# Altium schematic sheet Mainboard_v1_1.SchDoc: Aerator Converter V1.1
size 571 x 275 mm; CheckedBy: Dr. Hung; DrawnBy: Thanh Tam; Engineer: Thanh Tam; SheetNumber: 1; SheetTotal: 3
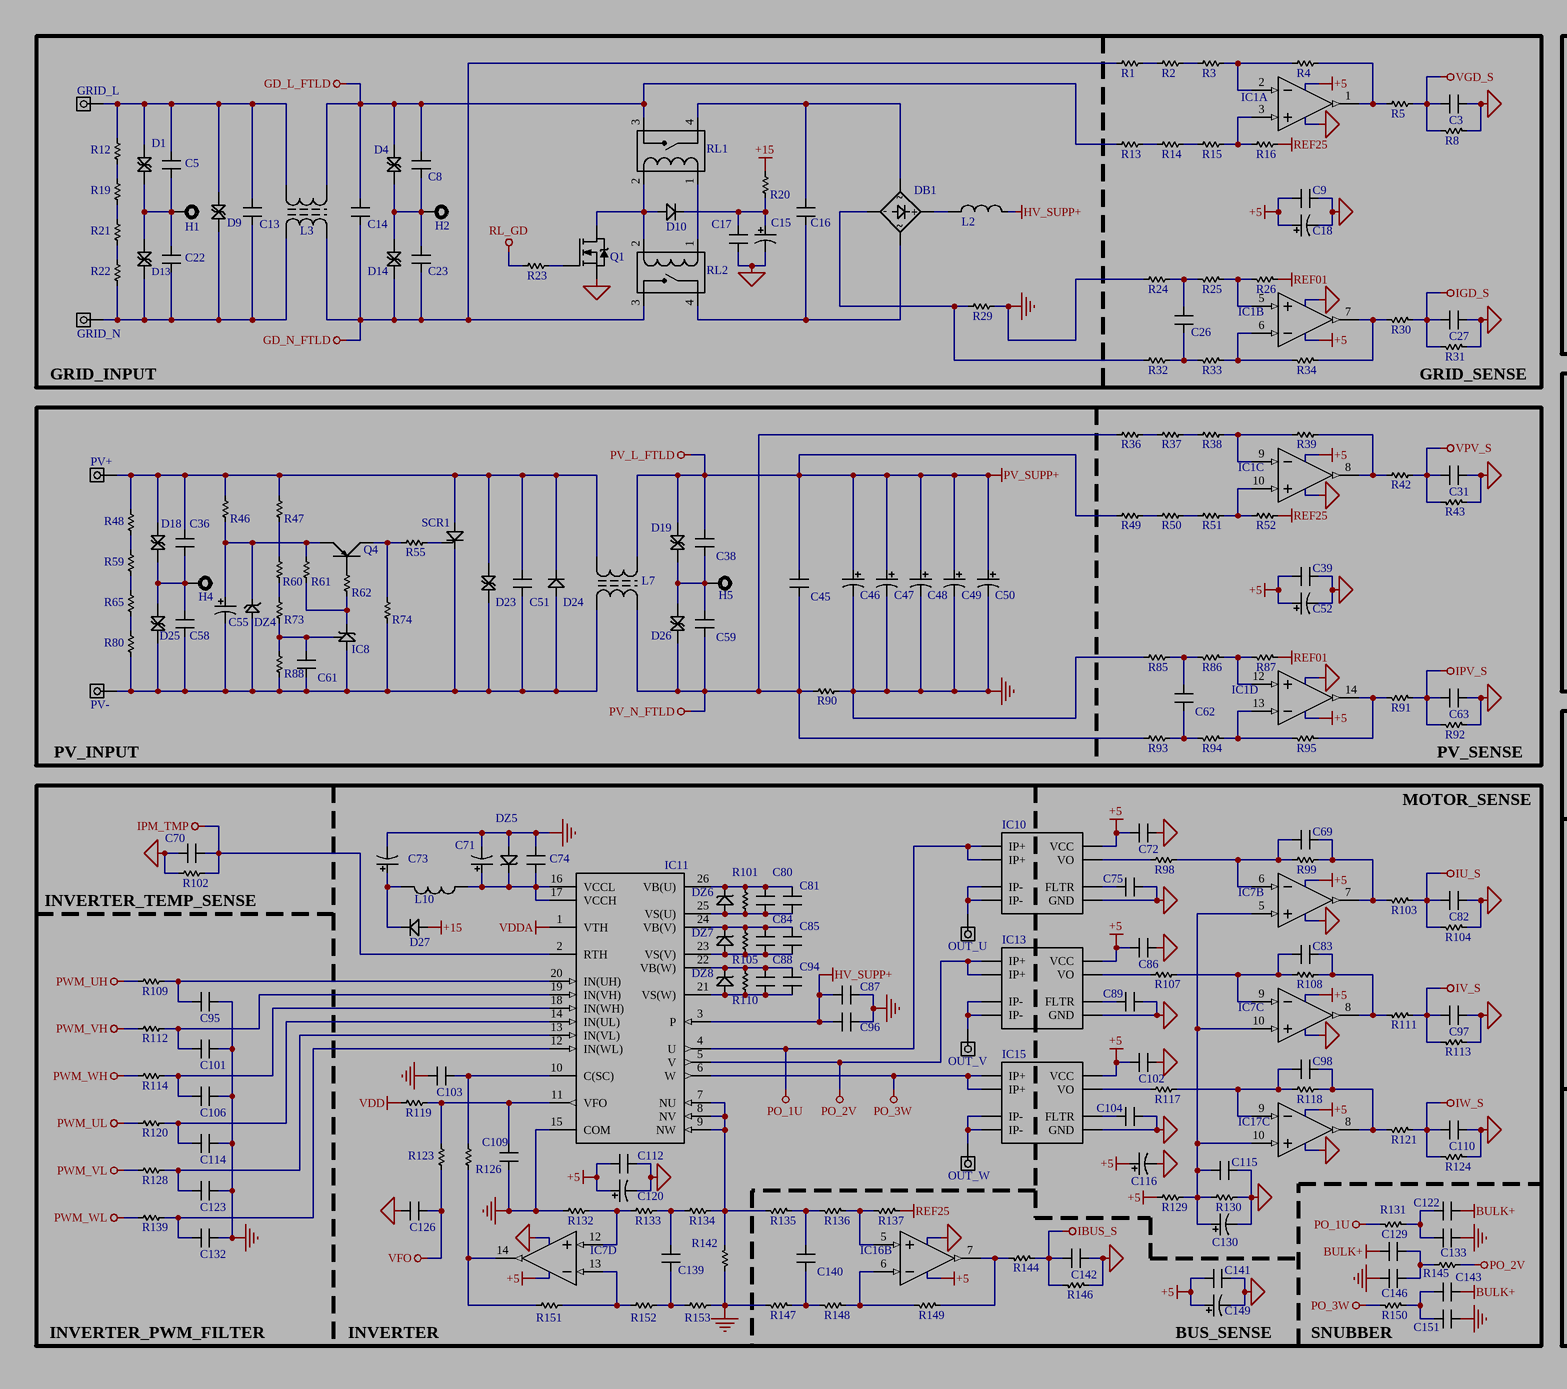
[diagram p0: Mainboard_v1_1.SchDoc, left]
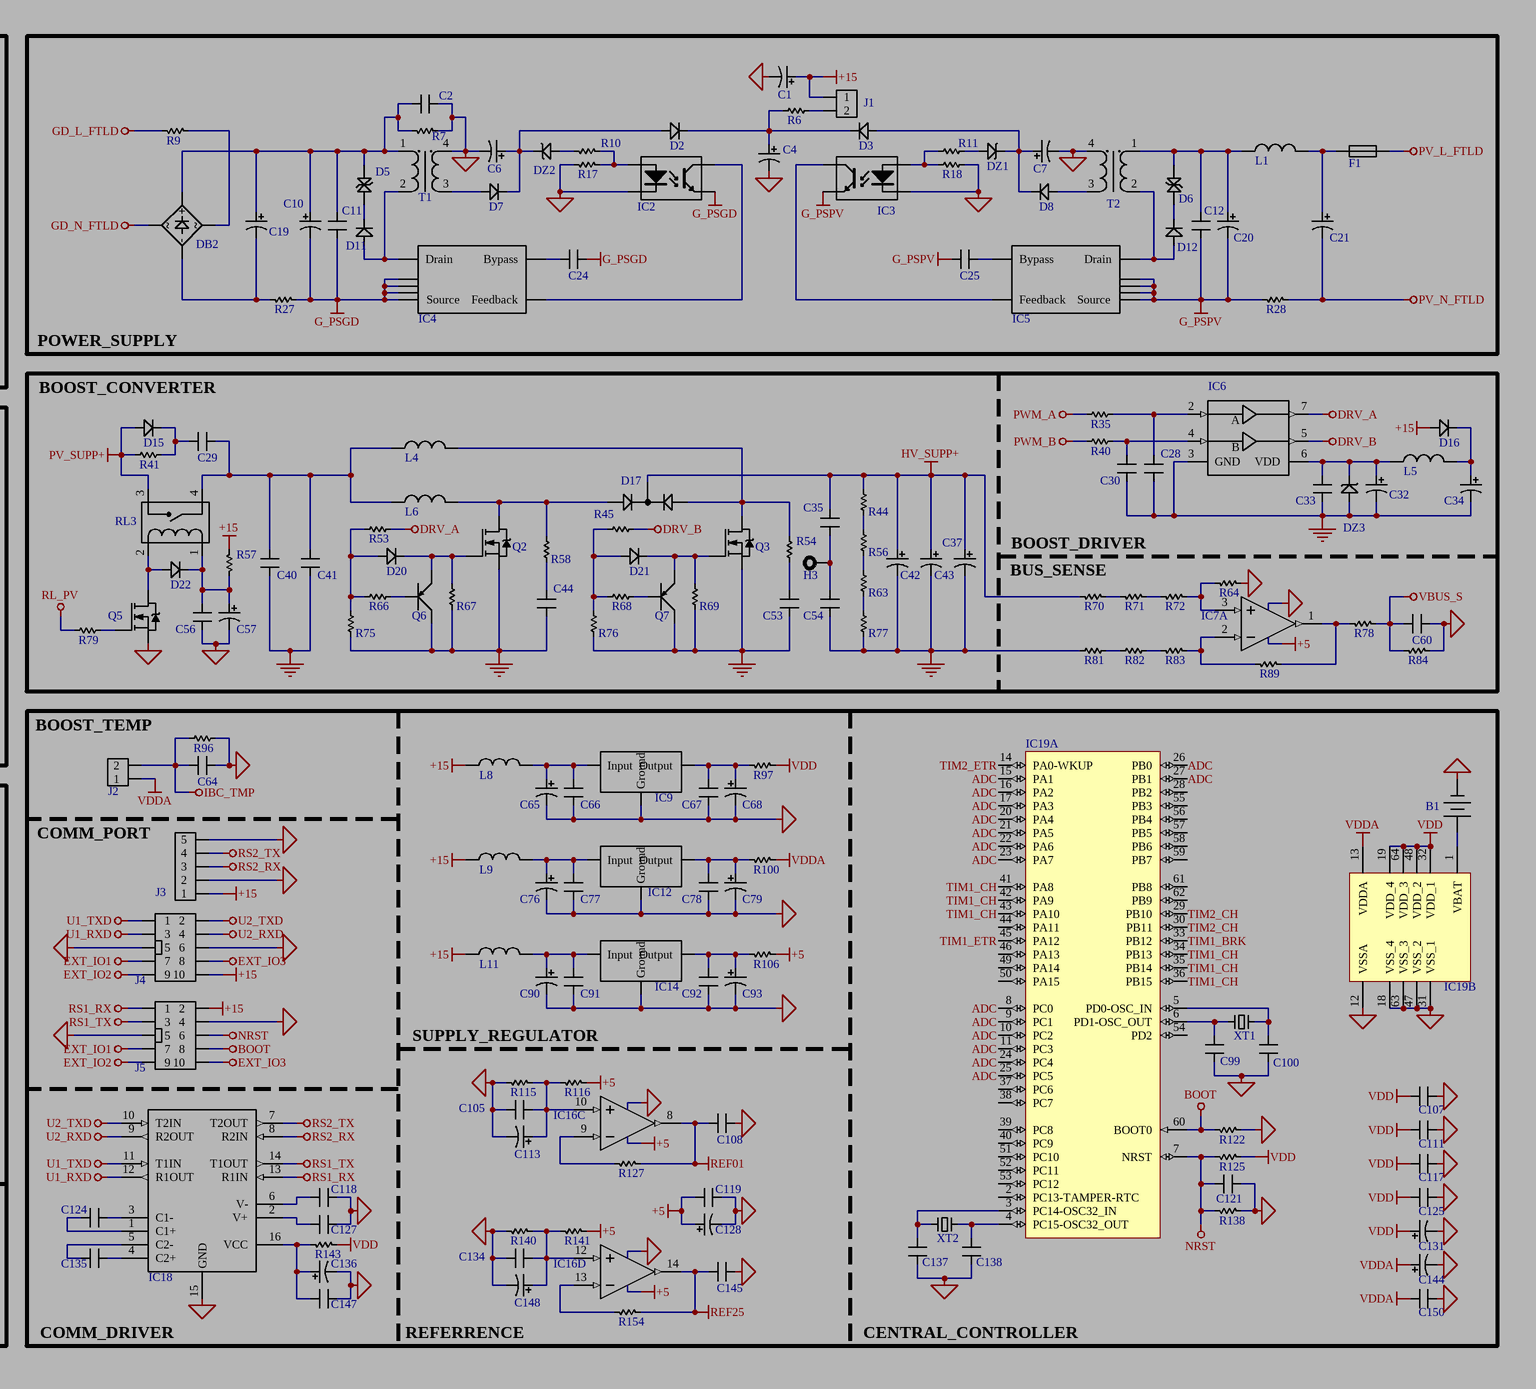
[diagram p1: Mainboard_v1_1.SchDoc, right]

## Parts
B1  BATTERY  (value not drawn)
C1  CAP-POL  [CAP-ELECT-5]  (value not drawn)
C2  104  [CAP20]  (value not drawn)
C3  104  [CAP20]  (value not drawn)
C4  CAP-POL  [CAP-ELECT-5]  (value not drawn)
C5  104  [CAP20]  (value not drawn)
C6  CAP-POL  [CAP-ELECT-5]  (value not drawn)
C7  CAP-POL  [CAP-ELECT-5]  (value not drawn)
C8  104  [CAP20]  (value not drawn)
C9  104  [CAP20]  (value not drawn)
C10  CAP-POL  [CAP-ELECT-5]  (value not drawn)
C11  104  [CAP20]  (value not drawn)
C12  104  [CAP20]  (value not drawn)
C13  104  [CAP20]  (value not drawn)
C14  104  [CAP20]  (value not drawn)
C15  CAP-POL  [CAP-ELECT-5]  (value not drawn)
C16  NULL  [CAP20]  (value not drawn)
C17  CAP  [CAP20]  (value not drawn)
C18  CAP-POL  [CAP-ELECT-5]  (value not drawn)
C19  CAP-POL  [CAP-ELECT-5]  (value not drawn)
C20  CAP-POL  [CAP-ELECT-5]  (value not drawn)
C21  CAP-POL  [CAP-ELECT-5]  (value not drawn)
C22  104  [CAP20]  (value not drawn)
C23  104  [CAP20]  (value not drawn)
C24  104  [CAP20]  (value not drawn)
C25  104  [CAP20]  (value not drawn)
C26  104  [CAP20]  (value not drawn)
C27  104  [CAP20]  (value not drawn)
C28  104  [CAP20]  (value not drawn)
C29  104  [CAP20]  (value not drawn)
C30  104  [CAP20]  (value not drawn)
C31  104  [CAP20]  (value not drawn)
C32  CAP-POL  [CAP-ELECT-5]  (value not drawn)
C33  104  [CAP20]  (value not drawn)
C34  CAP-POL  [CAP-ELECT-5]  (value not drawn)
C35  104  [CAP20]  (value not drawn)
C36  104  [CAP20]  (value not drawn)
C37  CAP-POL  [CAP-ELECT-5]  (value not drawn)
C38  104  [CAP20]  (value not drawn)
C39  104  [CAP20]  (value not drawn)
C40  104  [CAP20]  (value not drawn)
C41  104  [CAP20]  (value not drawn)
C42  CAP-POL  [CAP-ELECT-5]  (value not drawn)
C43  CAP-POL  [CAP-ELECT-5]  (value not drawn)
C44  104  [CAP20]  (value not drawn)
C45  104  [CAP20]  (value not drawn)
C46  CAP-POL  [CAP-ELECT-5]  (value not drawn)
C47  CAP-POL  [CAP-ELECT-5]  (value not drawn)
C48  CAP-POL  [CAP-ELECT-5]  (value not drawn)
C49  CAP-POL  [CAP-ELECT-5]  (value not drawn)
C50  CAP-POL  [CAP-ELECT-5]  (value not drawn)
C51  104  [CAP20]  (value not drawn)
C52  CAP-POL  [CAP-ELECT-5]  (value not drawn)
C53  104  [CAP20]  (value not drawn)
C54  104  [CAP20]  (value not drawn)
C55  CAP-POL  [CAP-ELECT-5]  (value not drawn)
C56  104  [CAP20]  (value not drawn)
C57  CAP-POL  [CAP-ELECT-5]  (value not drawn)
C58  104  [CAP20]  (value not drawn)
C59  104  [CAP20]  (value not drawn)
C60  104  [CAP20]  (value not drawn)
C61  104  [CAP20]  (value not drawn)
C62  104  [CAP20]  (value not drawn)
C63  104  [CAP20]  (value not drawn)
C64  104  [CAP20]  (value not drawn)
C65  CAP-POL  [CAP-ELECT-5]  (value not drawn)
C66  CAP  [CAP20]  (value not drawn)
C67  CAP  [CAP20]  (value not drawn)
C68  CAP-POL  [CAP-ELECT-5]  (value not drawn)
C69  104  [CAP20]  (value not drawn)
C70  104  [CAP20]  (value not drawn)
C71  CAP-POL  [CAP-ELECT-5]  (value not drawn)
C72  104  [CAP20]  (value not drawn)
C73  CAP-POL  [CAP-ELECT-5]  (value not drawn)
C74  104  [CAP20]  (value not drawn)
C75  104  [CAP20]  (value not drawn)
C76  CAP-POL  [CAP-ELECT-5]  (value not drawn)
C77  CAP  [CAP20]  (value not drawn)
C78  CAP  [CAP20]  (value not drawn)
C79  CAP-POL  [CAP-ELECT-5]  (value not drawn)
C80  104  [CAP20]  (value not drawn)
C81  104  [CAP20]  (value not drawn)
C82  104  [CAP20]  (value not drawn)
C83  104  [CAP20]  (value not drawn)
C84  104  [CAP20]  (value not drawn)
C85  104  [CAP20]  (value not drawn)
C86  104  [CAP20]  (value not drawn)
C87  104  [CAP20]  (value not drawn)
C88  104  [CAP20]  (value not drawn)
C89  104  [CAP20]  (value not drawn)
C90  CAP-POL  [CAP-ELECT-5]  (value not drawn)
C91  CAP  [CAP20]  (value not drawn)
C92  CAP  [CAP20]  (value not drawn)
C93  CAP-POL  [CAP-ELECT-5]  (value not drawn)
C94  104  [CAP20]  (value not drawn)
C95  104  [CAP20]  (value not drawn)
C96  104  [CAP20]  (value not drawn)
C97  104  [CAP20]  (value not drawn)
C98  104  [CAP20]  (value not drawn)
C99  CAP  [CAP20]  (value not drawn)
C100  CAP  [CAP20]  (value not drawn)
C101  104  [CAP20]  (value not drawn)
C102  104  [CAP20]  (value not drawn)
C103  104  [CAP20]  (value not drawn)
C104  104  [CAP20]  (value not drawn)
C105  104  [CAP20]  (value not drawn)
C106  104  [CAP20]  (value not drawn)
C107  CAP  [CAP20]  (value not drawn)
C108  104  [CAP20]  (value not drawn)
C109  104  [CAP20]  (value not drawn)
C110  104  [CAP20]  (value not drawn)
C111  CAP  [CAP20]  (value not drawn)
C112  104  [CAP20]  (value not drawn)
C113  CAP-POL  [CAP-ELECT-5]  (value not drawn)
C114  104  [CAP20]  (value not drawn)
C115  104  [CAP20]  (value not drawn)
C116  CAP-POL  [CAP-ELECT-5]  (value not drawn)
C117  CAP  [CAP20]  (value not drawn)
C118  CAP  [CAP20]  (value not drawn)
C119  104  [CAP20]  (value not drawn)
C120  CAP-POL  [CAP-ELECT-5]  (value not drawn)
C121  104  [CAP20]  (value not drawn)
C122  104  [CAP20]  (value not drawn)
C123  104  [CAP20]  (value not drawn)
C124  CAP  [CAP20]  (value not drawn)
C125  CAP  [CAP20]  (value not drawn)
C126  104  [CAP20]  (value not drawn)
C127  CAP  [CAP20]  (value not drawn)
C128  CAP-POL  [CAP-ELECT-5]  (value not drawn)
C129  104  [CAP20]  (value not drawn)
C130  CAP-POL  [CAP-ELECT-5]  (value not drawn)
C131  CAP-POL  [CAP-ELECT-5]  (value not drawn)
C132  104  [CAP20]  (value not drawn)
C133  104  [CAP20]  (value not drawn)
C134  104  [CAP20]  (value not drawn)
C135  CAP  [CAP20]  (value not drawn)
C136  CAP-POL  [CAP-ELECT-5]  (value not drawn)
C137  CAP  [CAP20]  (value not drawn)
C138  CAP  [CAP20]  (value not drawn)
C139  104  [CAP20]  (value not drawn)
C140  104  [CAP20]  (value not drawn)
C141  104  [CAP20]  (value not drawn)
C142  104  [CAP20]  (value not drawn)
C143  104  [CAP20]  (value not drawn)
C144  CAP-POL  [CAP-ELECT-5]  (value not drawn)
C145  104  [CAP20]  (value not drawn)
C146  104  [CAP20]  (value not drawn)
C147  CAP  [CAP20]  (value not drawn)
C148  CAP-POL  [CAP-ELECT-5]  (value not drawn)
C149  CAP-POL  [CAP-ELECT-5]  (value not drawn)
C150  CAP  [CAP20]  (value not drawn)
C151  104  [CAP20]  (value not drawn)
D1  DB3  [DIA_DB3]  (value not drawn)
D2  Diode  [DIO_DO41]  (value not drawn)
D3  Diode  [DIO_DO41]  (value not drawn)
D4  DB3  [DIA_DB3]  (value not drawn)
D5  Diode TVS  [DIO_DO15-TVS]  (value not drawn)
D6  Diode TVS  [DIO_DO15-TVS]  (value not drawn)
D7  Diode  [DIO_DO41]  (value not drawn)
D8  Diode  [DIO_DO41]  (value not drawn)
D9  DB3  [DIA_DB3]  (value not drawn)
D10  Diode  [DIO_DO41]  (value not drawn)
D11  Diode  [DIO_DO41]  (value not drawn)
D12  Diode  [DIO_DO41]  (value not drawn)
D13  DB3  [DIA_DB3]  (value not drawn)
D14  DB3  [DIA_DB3]  (value not drawn)
D15  Diode  [DIO_DO41]  (value not drawn)
D16  Diode  [DIO_DO41]  (value not drawn)
D17  Diode Dual  [TO-220]  (value not drawn)
D18  DB3  [DIA_DB3]  (value not drawn)
D19  DB3  [DIA_DB3]  (value not drawn)
D20  Diode  [DIO_DO41]  (value not drawn)
D21  Diode  [DIO_DO41]  (value not drawn)
D22  Diode  [DIO_DO41]  (value not drawn)
D23  DB3  [DIA_DB3]  (value not drawn)
D24  Diode  [DIO_DO41]  (value not drawn)
D25  DB3  [DIA_DB3]  (value not drawn)
D26  DB3  [DIA_DB3]  (value not drawn)
D27  Diode  [DIO_DO41]  (value not drawn)
DB1  Diode Bridge  [DB25A]  (value not drawn)
DB2  Diode Bridge  [DB25A]  (value not drawn)
DZ1  Diode Zener  [DIO_DZ1W]  (value not drawn)
DZ2  Diode Zener  [DIO_DZ1W]  (value not drawn)
DZ3  Diode Zener  [DIO_DZ1W]  (value not drawn)
DZ4  Diode Zener  [DIO_DZ1W]  (value not drawn)
DZ5  Diode Zener  [DIO_DZ1W]  (value not drawn)
DZ6  Diode Zener  [DIO_DZ1W]  (value not drawn)
DZ7  Diode Zener  [DIO_DZ1W]  (value not drawn)
DZ8  Diode Zener  [DIO_DZ1W]  (value not drawn)
F1  Fuse  [F5x20]  (value not drawn)
H1  HOLE  [HOLE_M3]  (value not drawn)
H2  HOLE  [HOLE_M3]  (value not drawn)
H3  HOLE  [HOLE_M3]  (value not drawn)
H4  HOLE  [HOLE_M3]  (value not drawn)
H5  HOLE  [HOLE_M3]  (value not drawn)
IC1  MCP6024  [SO14]  (value not drawn)  (parts A,B,C,D of 4)
IC2  PC817  [DIP4]  (value not drawn)
IC3  PC817  [DIP4]  (value not drawn)
IC4  TNY27x  [DIP7-WO3]  (value not drawn)
IC5  TNY27x  [DIP7-WO3]  (value not drawn)
IC6  TC4424  [SO8]  (value not drawn)
IC7  MCP6024  [SO14]  (value not drawn)  (parts A,B,C,D of 4)
IC8  TL431  [TO-92]  (value not drawn)
IC9  KA78xx  [TO-220]  (value not drawn)
IC10  ACS712  [SO8]  (value not drawn)
IC11  FNB41560  [FNB41560]  (value not drawn)
IC12  KA78xx  [TO-220]  (value not drawn)
IC13  ACS712  [SO8]  (value not drawn)
IC14  KA78xx  [TO-220]  (value not drawn)
IC15  ACS712  [SO8]  (value not drawn)
IC16  MCP6024  [SO14]  (value not drawn)  (parts B,C,D of 4)
IC17  MCP6024  [SO14]  (value not drawn)  (part C of 4)
IC18  MAX3232  (value not drawn)
IC19  STM32F103RBT6  [STM-LQFP64_N]  (value not drawn)  (parts A,B of 2)
J1  Header2  [HDR2]  (value not drawn)
J2  Header2  [HDR2]  (value not drawn)
J3  Header5  (value not drawn)
J4  Header5x2  (value not drawn)
J5  Header5x2  (value not drawn)
L1  Inductor  [IND_UPS3K]  (value not drawn)
L2  Inductor  [IND_UPS3K]  (value not drawn)
L3  EMI_CHOKE  [IND_EMI]  (value not drawn)
L4  Inductor  [IND_UPS3K]  (value not drawn)
L5  Inductor  [IND_UPS3K]  (value not drawn)
L6  Inductor  [IND_UPS3K]  (value not drawn)
L7  EMI_CHOKE  [IND_EMI]  (value not drawn)
L8  Inductor  [IND_UPS3K]  (value not drawn)
L9  Inductor  [IND_UPS3K]  (value not drawn)
L10  Inductor  [IND_UPS3K]  (value not drawn)
L11  Inductor  [IND_UPS3K]  (value not drawn)
Q1  MOSFET_N  [TO-220]  (value not drawn)
Q2  MOSFET_N  [TO-220]  (value not drawn)
Q3  MOSFET_N  [TO-220]  (value not drawn)
Q4  BJT_PNP  [TO-92]  (value not drawn)
Q5  MOSFET_N  [TO-220]  (value not drawn)
Q6  BJT_PNP  [TO-92]  (value not drawn)
Q7  BJT_PNP  [TO-92]  (value not drawn)
R1  RES  [RES35]  (value not drawn)
R2  RES  [RES35]  (value not drawn)
R3  RES  [RES35]  (value not drawn)
R4  RES  [RES35]  (value not drawn)
R5  RES  [RES35]  (value not drawn)
R6  RES  [RES35]  (value not drawn)
R7  RES  [RES35]  (value not drawn)
R8  RES  [RES35]  (value not drawn)
R9  RES  [RES35]  (value not drawn)
R10  RES  [RES35]  (value not drawn)
R11  RES  [RES35]  (value not drawn)
R12  RES  [RES35]  (value not drawn)
R13  RES  [RES35]  (value not drawn)
R14  RES  [RES35]  (value not drawn)
R15  RES  [RES35]  (value not drawn)
R16  RES  [RES35]  (value not drawn)
R17  RES  [RES35]  (value not drawn)
R18  RES  [RES35]  (value not drawn)
R19  RES  [RES35]  (value not drawn)
R20  RES  [RES35]  (value not drawn)
R21  RES  [RES35]  (value not drawn)
R22  RES  [RES35]  (value not drawn)
R23  RES  [RES35]  (value not drawn)
R24  RES  [RES35]  (value not drawn)
R25  RES  [RES35]  (value not drawn)
R26  RES  [RES35]  (value not drawn)
R27  RES  [RES35]  (value not drawn)
R28  RES  [RES35]  (value not drawn)
R29  RES  [RES35]  (value not drawn)
R30  RES  [RES35]  (value not drawn)
R31  RES  [RES35]  (value not drawn)
R32  RES  [RES35]  (value not drawn)
R33  RES  [RES35]  (value not drawn)
R34  RES  [RES35]  (value not drawn)
R35  RES  [RES35]  (value not drawn)
R36  RES  [RES35]  (value not drawn)
R37  RES  [RES35]  (value not drawn)
R38  RES  [RES35]  (value not drawn)
R39  RES  [RES35]  (value not drawn)
R40  RES  [RES35]  (value not drawn)
R41  RES  [RES35]  (value not drawn)
R42  RES  [RES35]  (value not drawn)
R43  RES  [RES35]  (value not drawn)
R44  RES  [RES35]  (value not drawn)
R45  RES  [RES35]  (value not drawn)
R46  RES  [RES35]  (value not drawn)
R47  RES  [RES35]  (value not drawn)
R48  RES  [RES35]  (value not drawn)
R49  RES  [RES35]  (value not drawn)
R50  RES  [RES35]  (value not drawn)
R51  RES  [RES35]  (value not drawn)
R52  RES  [RES35]  (value not drawn)
R53  RES  [RES35]  (value not drawn)
R54  RES  [RES35]  (value not drawn)
R55  RES  [RES35]  (value not drawn)
R56  RES  [RES35]  (value not drawn)
R57  RES  [RES35]  (value not drawn)
R58  RES  [RES35]  (value not drawn)
R59  RES  [RES35]  (value not drawn)
R60  RES  [RES35]  (value not drawn)
R61  RES  [RES35]  (value not drawn)
R62  RES  [RES35]  (value not drawn)
R63  RES  [RES35]  (value not drawn)
R64  RES  [RES35]  (value not drawn)
R65  RES  [RES35]  (value not drawn)
R66  RES  [RES35]  (value not drawn)
R67  RES  [RES35]  (value not drawn)
R68  RES  [RES35]  (value not drawn)
R69  RES  [RES35]  (value not drawn)
R70  RES  [RES35]  (value not drawn)
R71  RES  [RES35]  (value not drawn)
R72  RES  [RES35]  (value not drawn)
R73  RES  [RES35]  (value not drawn)
R74  RES  [RES35]  (value not drawn)
R75  RES  [RES35]  (value not drawn)
R76  RES  [RES35]  (value not drawn)
R77  RES  [RES35]  (value not drawn)
R78  RES  [RES35]  (value not drawn)
R79  RES  [RES35]  (value not drawn)
R80  RES  [RES35]  (value not drawn)
R81  RES  [RES35]  (value not drawn)
R82  RES  [RES35]  (value not drawn)
R83  RES  [RES35]  (value not drawn)
R84  RES  [RES35]  (value not drawn)
R85  RES  [RES35]  (value not drawn)
R86  RES  [RES35]  (value not drawn)
R87  RES  [RES35]  (value not drawn)
R88  RES  [RES35]  (value not drawn)
R89  RES  [RES35]  (value not drawn)
R90  RES  [RES35]  (value not drawn)
R91  RES  [RES35]  (value not drawn)
R92  RES  [RES35]  (value not drawn)
R93  RES  [RES35]  (value not drawn)
R94  RES  [RES35]  (value not drawn)
R95  RES  [RES35]  (value not drawn)
R96  RES  [RES35]  (value not drawn)
R97  0  [RES35]  (value not drawn)
R98  Ri  [RES35]  (value not drawn)
R99  Rf  [RES35]  (value not drawn)
R100  0  [RES35]  (value not drawn)
R101  RES  [RES35]  (value not drawn)
R102  RES  [RES35]  (value not drawn)
R103  RES  [RES35]  (value not drawn)
R104  RES  [RES35]  (value not drawn)
R105  RES  [RES35]  (value not drawn)
R106  0  [RES35]  (value not drawn)
R107  Ri  [RES35]  (value not drawn)
R108  Rf  [RES35]  (value not drawn)
R109  RES  [RES35]  (value not drawn)
R110  RES  [RES35]  (value not drawn)
R111  RES  [RES35]  (value not drawn)
R112  RES  [RES35]  (value not drawn)
R113  RES  [RES35]  (value not drawn)
R114  RES  [RES35]  (value not drawn)
R115  RES  [RES35]  (value not drawn)
R116  RES  [RES35]  (value not drawn)
R117  Ri  [RES35]  (value not drawn)
R118  Rf  [RES35]  (value not drawn)
R119  RES  [RES35]  (value not drawn)
R120  RES  [RES35]  (value not drawn)
R121  RES  [RES35]  (value not drawn)
R122  2K2  [RES40]  (value not drawn)
R123  RES  [RES35]  (value not drawn)
R124  RES  [RES35]  (value not drawn)
R125  2K2  [RES40]  (value not drawn)
R126  RES  [RES35]  (value not drawn)
R127  RES  [RES35]  (value not drawn)
R128  RES  [RES35]  (value not drawn)
R129  RES  [RES35]  (value not drawn)
R130  RES  [RES35]  (value not drawn)
R131  RES  [RES35]  (value not drawn)
R132  RES  [RES35]  (value not drawn)
R133  RES  [RES35]  (value not drawn)
R134  RES  [RES35]  (value not drawn)
R135  RES  [RES35]  (value not drawn)
R136  RES  [RES35]  (value not drawn)
R137  RES  [RES35]  (value not drawn)
R138  2K2  [RES40]  (value not drawn)
R139  RES  [RES35]  (value not drawn)
R140  RES  [RES35]  (value not drawn)
R141  RES  [RES35]  (value not drawn)
R142  RES  [RES35]  (value not drawn)
R143  0  [RES35]  (value not drawn)
R144  RES  [RES35]  (value not drawn)
R145  RES  [RES35]  (value not drawn)
R146  RES  [RES35]  (value not drawn)
R147  RES  [RES35]  (value not drawn)
R148  RES  [RES35]  (value not drawn)
R149  RES  [RES35]  (value not drawn)
R150  RES  [RES35]  (value not drawn)
R151  RES  [RES35]  (value not drawn)
R152  RES  [RES35]  (value not drawn)
R153  RES  [RES35]  (value not drawn)
R154  RES  [RES35]  (value not drawn)
RL1  RELAY SPST  (value not drawn)
RL2  RELAY SPST  (value not drawn)
RL3  RELAY SPST  (value not drawn)
SCR1  SCR  [TO-220]  (value not drawn)
T1  PT_FLYBACK_2IN-2OUT  [E16_DRV]  (value not drawn)
T2  PT_FLYBACK_2IN-2OUT  [E16_DRV]  (value not drawn)
TP1  GRID_L  [TP90-50]
TP2  GRID_N  [TP90-50]
TP3  PV+  [TP90-50]
TP4  PV-  [TP90-50]
TP5  OUT_U  [TP90-50]
TP6  OUT_V  [TP90-50]
TP7  OUT_W  [TP90-50]
XT1  XTAL  [XTAL-49S-SMD]  (value not drawn)
XT2  XTAL  [XTAL-49S-SMD]  (value not drawn)

## Blocks framed on the sheet
POWER_SUPPLY: C1 C2 C4 C6 C7 C10-C12 C19-C21 C24 C25 D2 D3 D5-D8 D11 D12 DB2 DZ1 DZ2 F1 IC2-IC5 J1 L1 R6 R7 R9-R11 R17 R18 R27 R28 T1 T2

## Nets
+5: C9.1 C18.1 C39.1 C52.1 C72.1 C86.1 C102.1 C112.1 C116.1 C119.1 C120.1 C128.1 C141.1 C149.1 IC1.4(VDD) IC7.4(VDD) IC10.8(VCC) IC13.8(VCC) IC15.8(VCC) IC16.4(VDD) IC17.4(VDD) R106.2 R116.2 R129.2 R141.2
+15: C1.1 D16.1(A) D27.1(A) J1.1 J3.1 J4.10 J5.2 L8.2 L9.2 L11.2 R20.1 R57.1
BOOT: IC19.60(BOOT0) J5.8 R122.1
BULK+: C122.1 C129.1 C143.1
DRV_A: IC6.7(OUTA) R53.2
DRV_B: IC6.5(OUTB) R45.2
EXT_IO1: J4.7 J5.7
EXT_IO2: J4.9 J5.9
EXT_IO3: J4.8 J5.10
G_PSGD: C10.2 C11.2 C24.1 IC2.3(E) IC4.5(Source) IC4.6(Source) IC4.7(Source) IC4.8(Source) R27.1
G_PSPV: C12.2 C20.2 C25.1 IC3.3(E) IC5.5(Source) IC5.6(Source) IC5.7(Source) IC5.8(Source) R28.2
GD_L_FTLD: C8.2 C14.2 D4.2 L3.3 R9.2 R13.1 RL1.3(NO)
GD_N_FTLD: C14.1 C23.1 D14.1 DB2.2(AC1) L3.2 R1.1 RL2.3(NO)
GND: B1.2 C1.2 C2.2 C3.2 C4.2 C6.2 C7.2 C9.2 C15.2 C17.1 C18.2 C27.2 C28.1 C30.1 C31.2 C32.2 C33.1 C34.2 C37.2 C39.2 C40.1 C41.1 C42.2 C43.2 C44.1 C46.2 C47.2 C48.2 C49.2 C50.2 C52.2 C53.1 C54.1 C56.1 C57.2 C60.2 C63.2 C64.2 C65.2 C66.1 C67.1 C68.2 C70.2 C71.2 C72.2 C73.2 C74.1 C75.2 C76.2 C77.1 C78.1 C79.2 C82.2 C86.2 C87.1 C89.2 C90.2 C91.1 C92.1 C93.2 C95.2 C96.1 C97.2 C99.1 C100.1 C101.2 C102.2 C103.1 C104.2 C105.2 C106.2 C107.1 C108.1 C109.1 C110.2 C111.1 C112.2 C113.2 C114.2 C115.2 C116.2 C117.1 C118.2 C119.2 C120.2 C121.1 C123.2 C125.1 C126.1 C127.2 C128.2 C130.2 C131.2 C132.2 C133.2 C134.2 C136.2 C137.1 C138.1 C141.2 C142.2 C144.2 C145.1 C146.2 C147.1 C148.2 C149.2 C150.1 C151.2 DZ3.1(A) DZ5.1(A) IC1.11(VSS) IC2.2(K) IC3.2(K) IC6.3(GND) IC7.11(VSS) IC9.2(Ground) IC10.5(GND) IC11.15(COM) IC12.2(Ground) IC13.5(GND) IC14.2(Ground) IC15.5(GND) IC16.11(VSS) IC17.11(VSS) IC18.15(GND) IC19.12(VSSA) IC19.18(VSS_4) IC19.31(VSS_1) IC19.47(VSS_2) IC19.63(VSS_3) J3.2 J3.5 J4.5 J4.6 J5.4 J5.5 Q1.3(S) Q2.3(S) Q3.3(S) Q5.3(S) Q6.2(C) Q7.2(C) R7.1 R8.1 R17.1 R18.1 R24.1 R29.2 R31.1 R43.1 R64.1 R67.2 R69.2 R75.1 R76.1 R77.2 R81.2 R84.1 R85.1 R90.2 R92.1 R96.1 R102.1 R104.1 R113.1 R115.1 R122.2 R124.1 R130.1 R132.1 R138.2 R140.1 R142.1 R146.1 R147.1 R153.1 T1.4 T2.4
HV_SUPP+: C35.2 C37.1 C42.1 C43.1 C87.2 C96.2 D17.2(K) IC11.3(P) L2.2 R44.1 R70.2
IBC_TMP: C64.1 J2.2 R96.2
IBUS_S: C142.1 R144.1 R146.2
IGD_S: C27.1 R30.1 R31.2
IPM_TMP: C70.1 IC11.2(RTH) R102.2
IPV_S: C63.1 R91.1 R92.2
IU_S: C82.1 R103.1 R104.2
IV_S: C97.1 R111.1 R113.2
IW_S: C110.1 R121.1 R124.2
NRST: C121.2 IC19.7(NRST) J5.6 R125.1 R138.1
PO_1U: IC10.1(IP+) IC10.2(IP+) IC11.4(U) R131.2
PO_2V: IC11.5(V) IC13.1(IP+) IC13.2(IP+) R145.2
PO_3W: IC11.6(W) IC15.1(IP+) IC15.2(IP+) R150.2
PV_L_FTLD: C38.2 C45.2 C46.1 C47.1 C48.1 C49.1 C50.1 D15.1(A) D19.2 F1.2 L7.3 R41.1 R49.1 RL3.3(NO)  [also labelled PV_SUPP+]
PV_N_FTLD: C21.2 C45.1 C59.1 D26.1 L7.2 R28.1 R36.1 R90.1 R93.2
PWM_A: R35.1
PWM_B: R40.1
PWM_UH: R109.2
PWM_UL: R120.2
PWM_VH: R112.2
PWM_VL: R128.2
PWM_WH: R114.2
PWM_WL: R139.2
REF01: C108.2 IC16.8(VOUTC) R26.1 R87.1 R127.2
REF25: C145.2 IC16.14(VOUTD) R16.1 R52.1 R137.1 R154.2
RL_GD: R23.2
RL_PV: R79.2
RS1_RX: IC18.13(R1IN) J5.1
RS1_TX: IC18.14(T1OUT) J5.3
RS2_RX: IC18.8(R2IN) J3.3
RS2_TX: IC18.7(T2OUT) J3.4
U1_RXD: IC18.12(R1OUT) J4.3
U1_TXD: IC18.11(T1IN) J4.1
U2_RXD: IC18.9(R2OUT) J4.4
U2_TXD: IC18.10(T2IN) J4.2
VBUS_S: C60.1 R78.1 R84.2
VDD: C107.2 C111.2 C117.2 C125.2 C131.1 IC19.19(VDD_4) IC19.32(VDD_1) IC19.48(VDD_2) IC19.64(VDD_3) R97.2 R119.2 R125.2 R143.2
VDDA: C144.1 C150.2 IC11.1(VTH) IC19.13(VDDA) J2.1 R100.2
VFO: C126.2 R123.2
VGD_S: C3.1 R5.1 R8.2
VPV_S: C31.1 R42.1 R43.2
ADC: IC19.8(PC0) IC19.9(PC1) IC19.10(PC2) IC19.11(PC3) IC19.15(PA1) IC19.16(PA2) IC19.17(PA3) IC19.20(PA4) IC19.21(PA5) IC19.22(PA6) IC19.23(PA7) IC19.24(PC4) IC19.25(PC5) IC19.26(PB0) IC19.27(PB1)
TIM1_BRK: IC19.33(PB12)
TIM1_CH: IC19.34(PB13) IC19.35(PB14) IC19.36(PB15) IC19.41(PA8) IC19.42(PA9) IC19.43(PA10)
TIM1_ETR: IC19.45(PA12)
TIM2_CH: IC19.29(PB10) IC19.30(PB11)
TIM2_ETR: IC19.14(PA0-WKUP)
NetB1_1: B1.1 IC19.1(VBAT)
NetC2_1: C2.1 C10.1 C11.1 C19.1 D5.1(A) DB2.1(K) R7.2 T1.1
NetC4_1: C4.1 D2.2(K) D3.2(K) R6.1
NetC5_1: C5.1 C22.2 D1.1 D13.2 H1.0
NetC5_2: C5.2 C13.2 D1.2 D9.2 L3.4 R12.1 TP1.0
NetC6_1: C6.1 D2.1(A) D7.2(K) DZ2.2(K)
NetC7_1: C7.1 D3.1(A) D8.2(K) DZ1.2(K)
NetC8_1: C8.1 C23.2 D4.1 D14.2 H2.0
NetC12_1: C12.1 C20.1 D6.1(A) L1.2 T2.1
NetC13_1: C13.1 C22.1 D9.1 D13.1 L3.1 R22.2 TP2.0
NetC15_1: C15.1 C17.2 D10.2(K) R20.2
NetC16_1: C16.1 DB1.3(AC2) RL2.4(CT)
NetC16_2: C16.2 DB1.2(AC1) RL1.4(CT)
NetC19_2: C19.2 DB2.4(A) R27.2
NetC21_1: C21.1 F1.1 L1.1
NetC24_2: C24.2 IC4.2(Bypass)
NetC25_2: C25.2 IC5.2(Bypass)
NetC26_1: C26.1 R24.2 R25.1
NetC26_2: C26.2 R32.1 R33.1
NetC28_2: C28.2 IC6.2(INA) R35.2
NetC29_1: C29.1 C40.2 C41.2 L4.2 L6.2 RL3.4(CT)
NetC29_2: C29.2 D15.2(K) R41.2
NetC30_2: C30.2 IC6.4(INB) R40.2
NetC32_1: C32.1 C33.2 DZ3.2(K) IC6.6(VDD) L5.2
NetC34_1: C34.1 D16.2(K) L5.1
NetC35_1: C35.1 C54.2 H3.0
NetC36_1: C36.1 C58.2 D18.1 D25.2 H4.0
NetC36_2: C36.2 C51.2 D18.2 D23.2 D24.2(K) L7.4 R46.1 R47.1 R48.1 SCR1.3(A) TP3.0
NetC38_1: C38.1 C59.2 D19.1 D26.2 H5.0
NetC44_2: C44.2 R58.1
NetC51_1: C51.1 C55.2 C58.1 C61.1 D23.1 D24.1(A) D25.1 DZ4.1(A) IC8.2(A) L7.1 R74.2 R80.2 R88.2 SCR1.1(K) TP4.0
NetC53_2: C53.2 R54.1
NetC55_1: C55.1 DZ4.2(K) Q4.3(E) R46.2 R61.1
NetC56_2: C56.2 C57.1 D22.2(K) R57.2 RL3.1(COIL_A)
NetC61_2: C61.2 IC8.1(R) R73.2 R88.1
NetC62_1: C62.1 R85.2 R86.1
NetC62_2: C62.2 R93.1 R94.1
NetC65_1: C65.1 C66.2 IC9.1(Input) L8.1
NetC67_2: C67.2 C68.1 IC9.3(Output) R97.1
NetC69_1: C69.1 IC7.6(VINB-) R98.1 R99.2
NetC69_2: C69.2 IC7.7(VOUTB) R99.1 R103.2
NetC71_1: C71.1 C74.2 DZ5.2(K) IC11.16(VCCL) IC11.17(VCCH) L10.2
NetC73_1: C73.1 D27.2(K) L10.1
NetC75_1: C75.1 IC10.6(FLTR)
NetC76_1: C76.1 C77.2 IC12.1(Input) L9.1
NetC78_2: C78.2 C79.1 IC12.3(Output) R100.1
NetC80_1: C80.1 C81.1 DZ6.2(K) IC11.26(VB(U)) R101.2
NetC80_2: C80.2 C81.2 DZ6.1(A) IC11.25(VS(U)) R101.1
NetC83_1: C83.1 IC7.9(VINC-) R107.1 R108.2
NetC83_2: C83.2 IC7.8(VOUTC) R108.1 R111.2
NetC84_1: C84.1 C85.1 DZ7.2(K) IC11.24(VB(V)) R105.2
NetC84_2: C84.2 C85.2 DZ7.1(A) IC11.23(VS(V)) R105.1
NetC88_1: C88.1 C94.1 DZ8.2(K) IC11.22(VB(W)) R110.2
NetC88_2: C88.2 C94.2 DZ8.1(A) IC11.21(VS(W)) R110.1
NetC89_1: C89.1 IC13.6(FLTR)
NetC90_1: C90.1 C91.2 IC14.1(Input) L11.1
NetC92_2: C92.2 C93.1 IC14.3(Output) R106.1
NetC95_1: C95.1 IC11.20(IN(UH)) R109.1
NetC98_1: C98.1 IC17.9(VINC-) R117.1 R118.2
NetC98_2: C98.2 IC17.8(VOUTC) R118.1 R121.2
NetC99_2: C99.2 IC19.6(PD1-OSC_OUT) XT1.1
NetC100_2: C100.2 IC19.5(PD0-OSC_IN) XT1.2
NetC101_1: C101.1 IC11.19(IN(VH)) R112.1
NetC103_2: C103.2 IC11.10(C(SC)) R126.2
NetC104_1: C104.1 IC15.6(FLTR)
NetC105_1: C105.1 C113.1 IC16.10(VINC+) R115.2 R116.1
NetC106_1: C106.1 IC11.18(IN(WH)) R114.1
NetC109_2: C109.2 IC11.11(VFO) R119.1 R123.1
NetC114_1: C114.1 IC11.14(IN(UL)) R120.1
NetC115_1: C115.1 C130.1 IC7.5(VINB+) IC7.10(VINC+) IC17.10(VINC+) R129.1 R130.2
NetC118_1: C118.1 IC18.6(V-)
NetC122_2: C122.2 C133.1 R131.1
NetC123_1: C123.1 IC11.13(IN(VL)) R128.1
NetC124_1: C124.1 IC18.1(C1+)
NetC124_2: C124.2 IC18.3(C1-)
NetC127_1: C127.1 IC18.2(V+)
NetC129_2: C129.2 C146.1 R145.1
NetC132_1: C132.1 IC11.12(IN(WL)) R139.1
NetC134_1: C134.1 C148.1 IC16.12(VIND+) R140.2 R141.1
NetC135_1: C135.1 IC18.5(C2-)
NetC135_2: C135.2 IC18.4(C2+)
NetC136_1: C136.1 C147.2 IC18.16(VCC) R143.1
NetC137_2: C137.2 IC19.3(PC14-OSC32_IN) XT2.2
NetC138_2: C138.2 IC19.4(PC15-OSC32_OUT) XT2.1
NetC139_1: C139.1 R133.1 R134.2
NetC139_2: C139.2 R152.1 R153.2
NetC140_1: C140.1 R135.2 R136.1
NetC140_2: C140.2 R147.2 R148.1
NetC143_2: C143.2 C151.1 R150.1
NetD5_2: D5.2(K) D11.2(K)
NetD6_2: D6.2(K) D12.2(K)
NetD7_1: D7.1(A) T1.3
NetD8_1: D8.1(A) T2.3
NetD10_1: D10.1(A) Q1.2(D) RL1.2(COIL_A) RL2.2(COIL_A)
NetD11_1: D11.1(A) IC4.4(Drain) T1.2
NetD12_1: D12.1(A) IC5.4(Drain) T2.2
NetD17_1: D17.1(A1) L6.1 Q2.2(D) R58.2
NetD17_3: D17.3(A2) L4.1 Q3.2(D) R54.2
NetD20_1: D20.1(A) R53.1 R66.1 R75.2
NetD20_2: D20.2(K) Q2.1(G) Q6.3(E) R67.1
NetD21_1: D21.1(A) R45.1 R68.1 R76.2
NetD21_2: D21.2(K) Q3.1(G) Q7.3(E) R69.1
NetD22_1: D22.1(A) Q5.2(D) RL3.2(COIL_A)
NetDB1_1: DB1.1(K) L2.1
NetDB1_4: DB1.4(A) R29.1 R32.2
NetDB2_3: DB2.3(AC2) R9.1
NetDZ1_1: DZ1.1(A) R11.2
NetDZ2_1: DZ2.1(A) R10.2
NetIC1_1: IC1.1(VOUTA) R4.1 R5.2
NetIC1_2: IC1.2(VINA-) R3.2 R4.2
NetIC1_3: IC1.3(VINA+) R15.2 R16.2
NetIC1_5: IC1.5(VINB+) R25.2 R26.2
NetIC1_6: IC1.6(VINB-) R33.2 R34.2
NetIC1_7: IC1.7(VOUTB) R30.2 R34.1
NetIC1_8: IC1.8(VOUTC) R39.1 R42.2
NetIC1_9: IC1.9(VINC-) R38.2 R39.2
NetIC1_10: IC1.10(VINC+) R51.2 R52.2
NetIC1_12: IC1.12(VIND+) R86.2 R87.2
NetIC1_13: IC1.13(VIND-) R94.2 R95.2
NetIC1_14: IC1.14(VOUTD) R91.2 R95.1
NetIC2_1: IC2.1(A) R10.1 R17.2
NetIC2_4: IC2.4(C) IC4.1(Feedback)
NetIC3_1: IC3.1(A) R11.1 R18.2
NetIC3_4: IC3.4(C) IC5.1(Feedback)
NetIC7_1: IC7.1(VOUTA) R78.2 R89.1
NetIC7_2: IC7.2(VINA-) R83.2 R89.2
NetIC7_3: IC7.3(VINA+) R64.2 R72.2
NetIC7_12: IC7.12(VIND+) R132.2 R133.2
NetIC7_13: IC7.13(VIND-) R151.2 R152.2
NetIC7_14: IC7.14(VOUTD) R126.1 R151.1
NetIC8_3: IC8.3(K) R61.2 R62.1
NetIC10_3: IC10.3(IP-) IC10.4(IP-) TP5.0
NetIC10_7: IC10.7(VO) R98.2
NetIC11_7: IC11.7(NU) IC11.8(NV) IC11.9(NW) R134.1 R135.1 R142.2
NetIC13_3: IC13.3(IP-) IC13.4(IP-) TP6.0
NetIC13_7: IC13.7(VO) R107.2
NetIC15_3: IC15.3(IP-) IC15.4(IP-) TP7.0
NetIC15_7: IC15.7(VO) R117.2
NetIC16_5: IC16.5(VINB+) R136.2 R137.2
NetIC16_6: IC16.6(VINB-) R148.2 R149.2
NetIC16_7: IC16.7(VOUTB) R144.2 R149.1
NetIC16_9: IC16.9(VINC-) R127.1
NetIC16_13: IC16.13(VIND-) R154.1
NetJ1_2: J1.2 R6.2
NetQ1_1: Q1.1(G) R23.1
NetQ4_1: Q4.1(B) R62.2
NetQ4_2: Q4.2(C) R55.2 R74.1
NetQ5_1: Q5.1(G) R79.1
NetQ6_1: Q6.1(B) R66.2
NetQ7_1: Q7.1(B) R68.2
NetR1_2: R1.2 R2.1
NetR2_2: R2.2 R3.1
NetR12_2: R12.2 R19.1
NetR13_2: R13.2 R14.1
NetR14_2: R14.2 R15.1
NetR19_2: R19.2 R21.1
NetR21_2: R21.2 R22.1
NetR36_2: R36.2 R37.1
NetR37_2: R37.2 R38.1
NetR44_2: R44.2 R56.1
NetR47_2: R47.2 R60.1
NetR48_2: R48.2 R59.1
NetR49_2: R49.2 R50.1
NetR50_2: R50.2 R51.1
NetR55_1: R55.1 SCR1.3(G)
NetR56_2: R56.2 R63.1
NetR59_2: R59.2 R65.1
NetR60_2: R60.2 R73.1
NetR63_2: R63.2 R77.1
NetR65_2: R65.2 R80.1
NetR70_1: R70.1 R71.2
NetR71_1: R71.1 R72.1
NetR81_1: R81.1 R82.2
NetR82_1: R82.1 R83.1
NetRL1_1: RL1.1(COIL_A) RL2.1(COIL_A)

Not connected (* = marked no-connect by the designer): IC19 2(PC13-TAMPER-RTC) 28(PB2) 37(PC6) 38(PC7) 39(PC8) 40(PC9) 44(PA11) 46(PA13) 49(PA14) 50(PA15) 51(PC10) 52(PC11) 53(PC12) 54(PD2) 55(PB3) 56(PB4) 57(PB5) 58(PB6) 59(PB7) 61(PB8) 62(PB9)

## Notes on the sheet
- (near TP2) GRID_INPUT
- (near R31) GRID_SENSE
- BOOST_CONVERTER
- (near R70) BUS_SENSE
- BOOST_DRIVER
- (near TP4) PV_INPUT
- (near R92) PV_SENSE
- (near J2) BOOST_TEMP
- MOTOR_SENSE
- COMM_PORT
- (near R102) INVERTER_TEMP_SENSE
- SUPPLY_REGULATOR
- INVERTER_PWM_FILTER
- INVERTER
- (near C149) BUS_SENSE
- (near R150) SNUBBER
- COMM_DRIVER
- (near C148) REFERRENCE
- CENTRAL_CONTROLLER
- (in symbol Diode Bridge) ~; -; +
- (in symbol TC4424) A; B

## Library data of the parts
C2 C3 C5 C8 C9 C11-C14 C16 C22-C31 C33 C35 C36 C38-C41 C44 C45 C51 C53 C54 C56 C58-C64 C69 C70 C72 C74 C75 C80-C89 C94-C98 C101-C106 C108-C110 C112 C114 C115 C119 C121-C123 C126 C129 C132-C134 C139-C143 C145 C146 C151 = CAP
D2 D3 D7 D8 D10-D12 D15 D16 D20-D22 D24 D27 = Diode: Code - JEDEC: DO-214-AB; Value: 1N5007; Published: 8-Jun-2000; Revision: July-2002: Re-released for DXP Platform.; Publisher: Altium Limited
DB1 DB2 = Diode Bridge: pin to pad: 1>K 2>AC1 3>AC2 4>A
IC1 IC7 IC16 IC17 = MCP6024: Manufacturer: Microchip; PartNumber: MCP6024-I/SL; DatasheetVersion: revD, Feb-2009; PackageVersion: revBB, Aug-2009; PackageReference: SOIC-SL14; PackageDescription: 14-Lead Plastic Small Outline (SL) - Narrow, 3.90mm Body [SOIC]; Supplier 1: Digi-Key; Supplier Part Number 1: MCP6024-I/SL-ND; Supplier 2: Farnell; Supplier Part Number 2: 1292247; Supplier 3: Newark; Supplier Part Number 3: 61K2953; Supplier 4: Mouser; Supplier Part Number 4: 579-MCP6024-I/SL; Mounting Technology: Surface Mount; Code_JEDEC: MS-012-AB; Code_IPC: SOIC127P600-14; ComponentLink1Description: Manufacturer URL; ComponentLink1URL: http://www.microchip.com/; ComponentLink2Description: Datasheet; ComponentLink2URL: http://ww1.microchip.com/downloads/en/DeviceDoc/21685d.pdf; ComponentLink3Description: Package Specification; ComponentLink3URL: http://www.microchip.com/stellent/groups/techpub_sg/documents/packagingspec/en012702.pdf
IC9 IC12 IC14 = KA78xx: Three Terminal Regulator
IC11 = FNB41560: IGBT Array & Module Transistor, NPN, 15 A, 1.5 V, 32 W, 600 V, SPM26-AAA; MP: FNB41060; MF: ON Semiconductor; Availability: Unavailable; Package: PowerDIP-26 ON Semiconductor; Price: None; SnapEDA_Link: https://www.snapeda.com/parts/FNB41060/ON%20Semiconductor/view-part/?ref=snap; Value: *
IC18 = MAX3232: Manufacturer Part Number: MAX232DR; Manufacturer: Texas Instruments; Protocol: RS232; Number of Drivers/Receivers: 2/2; Voltage - Supply: 4.5 V ~ 5.5 V; Supplier 1: Digi-Key; Supplier Part Number 1: 296-14619-1-ND; RoHS: RoHS Compliant; Packaging: Cut Tape (CT); Type: Transceiver; Supplier Part Number: 296-14619-1-ND; Supplier: Digi-Key; Category: Integrated Circuits (ICs); Package / Case: 16-SOIC (3.9mm Width)
IC19 = STM32F103RBT6: ARM Cortex-M3 32-bit MCU, 128 KB Flash, 20 KB Internal RAM, 51 I/Os, 64-pin LQFP, -40 to 85 degC, Tray; A/D Converter: 2x12-bit (16 Channel); FLASH Size (Prog) (kB): 128; I/Os (High Current): 51; Internal RAM Size (kB): 20; Operating Frequency(F) (Processor speed) (MHz): 72; Supply Voltage(Vcc) min (V): 2; DatasheetVersion: Rev. 16; PackageVersion: Rev. 4, 06/2013; PackageReference: LQFP64; PackageDescription: 64-Pin Low Profile Quad Flat Package, 10 x 10 mm Body, 0.5 mm Pitch; Supplier 1: Digi-Key; Supplier Part Number 1: 497-6066-ND; Supplier 2: Farnell; Supplier Part Number 2: 1447640; Supplier 3: Newark; Supplier Part Number 3: 59M2183; Supplier 4: Newark; Supplier Part Number 4: 57P1224; Supplier 5: Mouser; Supplier Part Number 5: 511-STM32F103RBT6; Core: ARM Cortex-M3; Packing: Tray; Mounting Technology: Surface Mount; PartNumber: STM32F103RBT6; ComponentLink1Description: Manufacturer URL; ComponentLink1URL: http://www.st.com/web/en/home.html; ComponentLink2Description: Datasheet; ComponentLink2URL: http://www.st.com/st-web-ui/static/active/en/resource/technical/document/datasheet/CD00161566.pdf; ComponentLink3Description: Package Specification; ComponentLink3URL: http://www.st.com/st-web-ui/static/active/en/resource/technical/document/datasheet/DM00037051.pdf
J1 J2 = Header2: Manufacturer: W¨¹rth Elektronik eiSos GmbH; partNo: 613002143121; ComponentLink1 Description: Manufacturer; ComponentLink2 Description: Datasheet; NoPins: 02; Created Date: 29 March 2013; ComponentLink1URL: http://www.we-online.com; ComponentLink2URL: http://katalog.we-online.de/em/datasheet/6130xx143121.pdf; Created by: Karrer Zheng
R97-R100 R106-R108 R117 R118 R122 R125 R138 R143 = RES
T1 T2 = PT_FLYBACK_2IN-2OUT: 2 input 2 output flyback potential transformer; pin to pad: 2>5 3>6 4>10
TP1-TP7 = TP